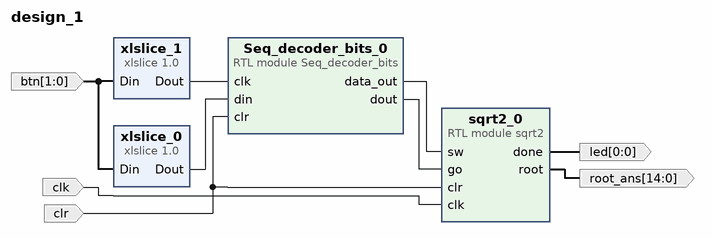
[diagram p0: block diagram of the top level]
# Vivado block design design_1, xc7z020clg400-1, Vivado 2022.1
create_bd_design design_1

create_bd_port -dir I -from 1 -to 0 btn
create_bd_port -dir O -from 0 -to 0 led
create_bd_port -dir O -from 14 -to 0 root_ans
create_bd_port -dir I clr
create_bd_port -dir I clk

create_bd_cell -type ip -vlnv xilinx.com:ip:xlslice:1.0 xlslice_0
set_property -dict {CONFIG.DIN_FROM 0 CONFIG.DIN_TO 0 CONFIG.DIN_WIDTH 2 CONFIG.DOUT_WIDTH 1} [get_bd_cells xlslice_0]
create_bd_cell -type ip -vlnv xilinx.com:ip:xlslice:1.0 xlslice_1
set_property -dict {CONFIG.DIN_FROM 1 CONFIG.DIN_TO 1 CONFIG.DIN_WIDTH 2 CONFIG.DOUT_WIDTH 1} [get_bd_cells xlslice_1]
create_bd_cell -type module -reference sqrt2 sqrt2_0
create_bd_cell -type module -reference Seq_decoder_bits Seq_decoder_bits_0

# ---- connections ----

connect_bd_net [get_bd_pins Seq_decoder_bits_0/data_out] [get_bd_pins sqrt2_0/sw]
connect_bd_net [get_bd_pins Seq_decoder_bits_0/dout] [get_bd_pins sqrt2_0/go]
connect_bd_net [get_bd_ports btn] [get_bd_pins xlslice_0/Din] [get_bd_pins xlslice_1/Din]
connect_bd_net [get_bd_ports clk] [get_bd_pins sqrt2_0/clk]
connect_bd_net [get_bd_ports clr] [get_bd_pins sqrt2_0/clr] [get_bd_pins Seq_decoder_bits_0/clr]
connect_bd_net [get_bd_pins sqrt2_0/done] [get_bd_ports led]
connect_bd_net [get_bd_pins sqrt2_0/root] [get_bd_ports root_ans]
connect_bd_net [get_bd_pins xlslice_0/Dout] [get_bd_pins Seq_decoder_bits_0/din]
connect_bd_net [get_bd_pins xlslice_1/Dout] [get_bd_pins Seq_decoder_bits_0/clk]

validate_bd_design
save_bd_design
